# EAGLE schematic solenoid_board (EAGLE 6.3)
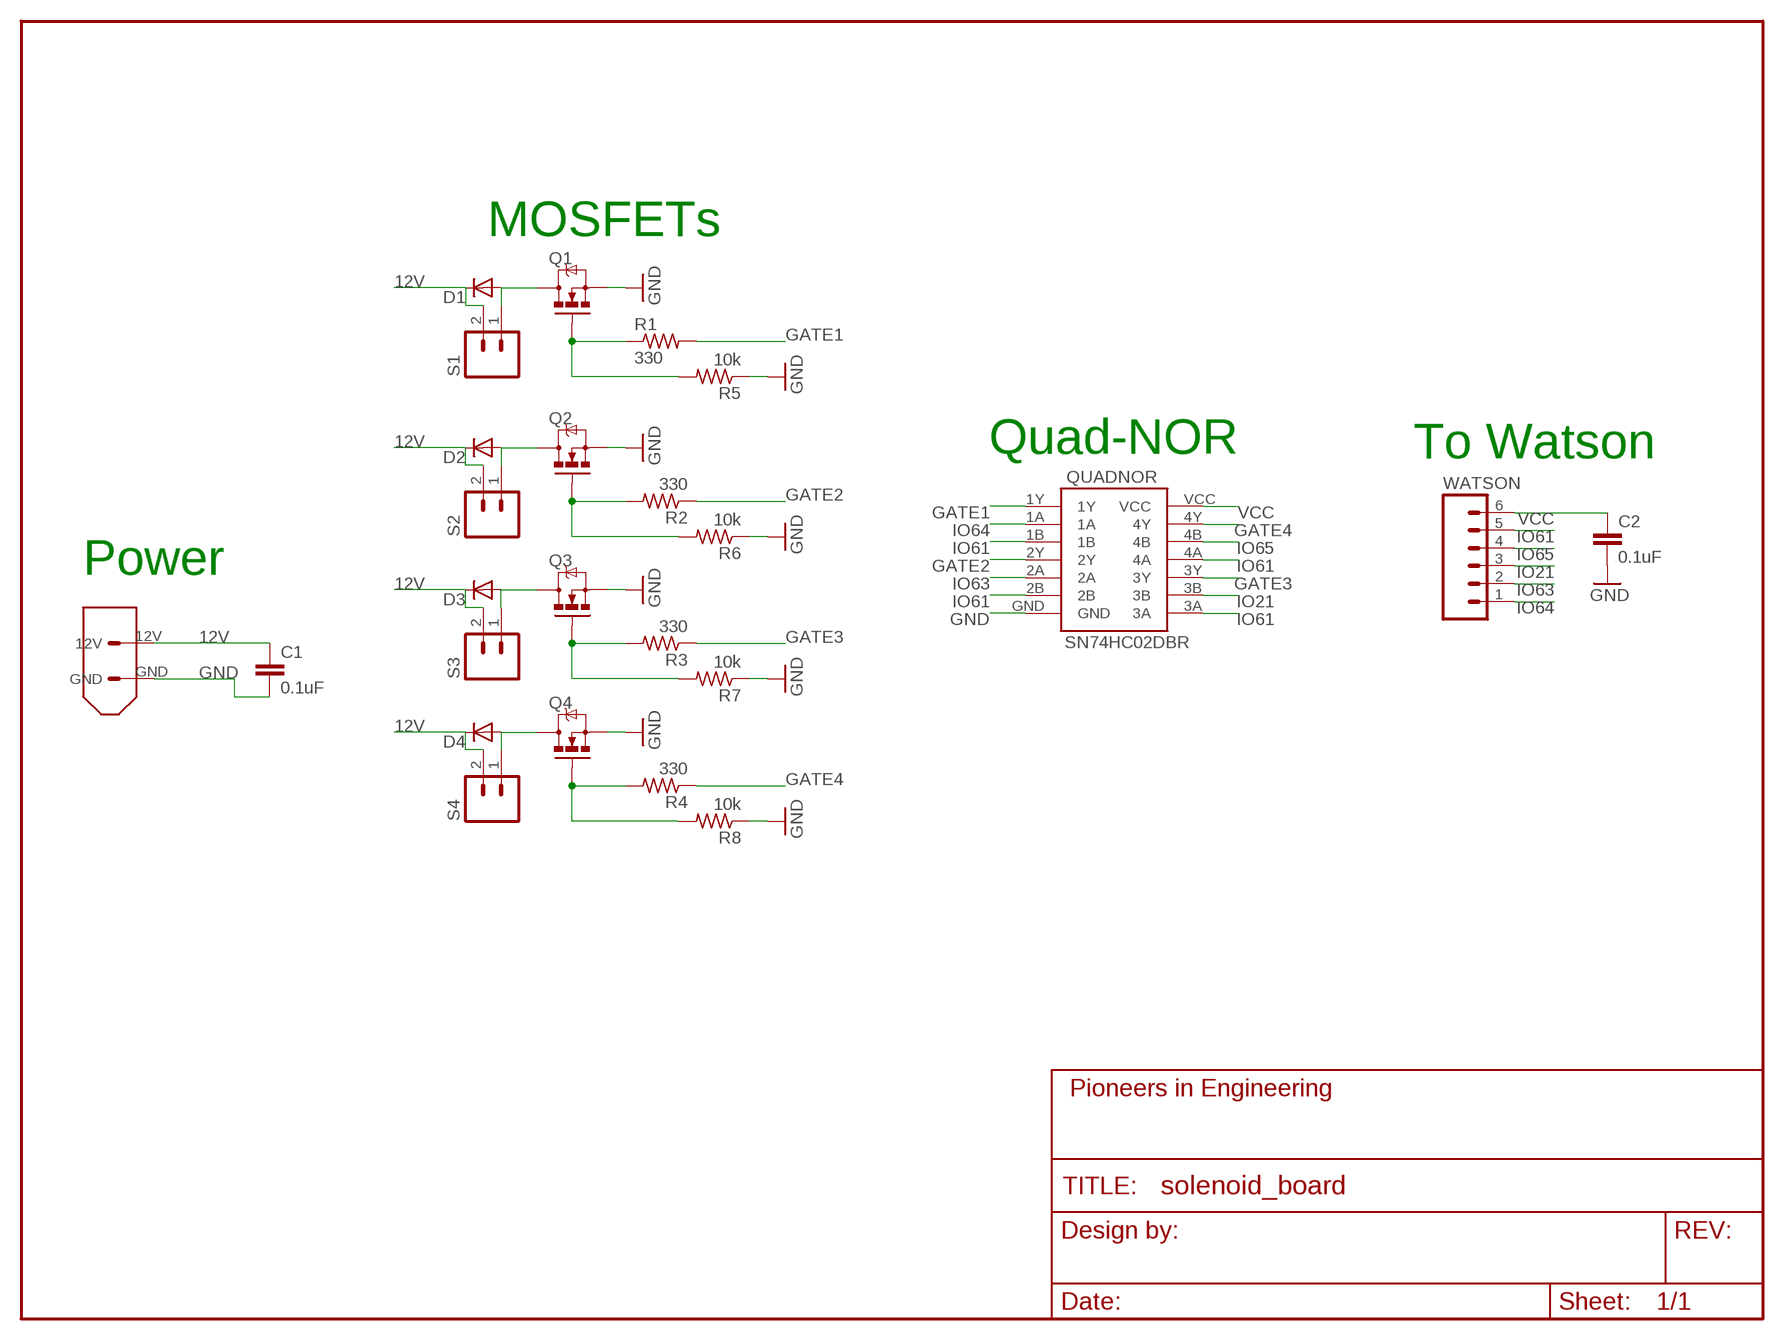
[diagram p0: schematic, sheet 1]
FRAME1 (FRAME-LETTER): AUTHOR: Sumita Ghosh, Sahar Mesri; REVISION: F

## Parts
C1  0.1uF  CAP0603-CAP  [0603-CAP]
C2  0.1uF  CAP0603-CAP  [0603-CAP]
D1  DIODESMA-ALT  [SMA-DIODE_ALT]
D2  DIODESMA-ALT  [SMA-DIODE_ALT]
D3  DIODESMA-ALT  [SMA-DIODE_ALT]
D4  DIODESMA-ALT  [SMA-DIODE_ALT]
Q1  MOSFET-NCHANNELSMD  [SOT23-3]
Q2  MOSFET-NCHANNELSMD  [SOT23-3]
Q3  MOSFET-NCHANNELSMD  [SOT23-3]
Q4  MOSFET-NCHANNELSMD  [SOT23-3]
QUADNOR  SN74HC02DBR  [QUADNOR]
R1  330  R-US_R0603  [R0603]
R2  330  R-US_R0603  [R0603]
R3  330  R-US_R0603  [R0603]
R4  330  R-US_R0603  [R0603]
R5  10k  R-US_R0603  [R0603]
R6  10k  R-US_R0603  [R0603]
R7  10k  R-US_R0603  [R0603]
R8  10k  R-US_R0603  [R0603]
S1  M021X02-MTA  [1X02-MTA]
S2  M021X02-MTA  [1X02-MTA]
S3  M021X02-MTA  [1X02-MTA]
S4  M021X02-MTA  [1X02-MTA]
U$2  XT60CONNECTOR  [XT60CONNECTOR]
WATSON  M06  [1X06-MTA]

## Nets
12V [power]: C1.1 D1.C D2.C D3.C D4.C S1.2 S2.2 S3.2 S4.2 U$2.12V
GATE1: QUADNOR.1Y R1.2
GATE2: QUADNOR.2Y R2.1
GATE3: QUADNOR.3Y R3.1
GATE4: QUADNOR.4Y R4.1
GND: C1.2 C2.2 Q1.2(S) Q2.2(S) Q3.2(S) Q4.2(S) QUADNOR.GND R5.1 R6.1 R7.1 R8.1 U$2.GND
IO21: QUADNOR.3B WATSON.3
IO61: QUADNOR.1B QUADNOR.2B QUADNOR.3A QUADNOR.4A WATSON.5
IO63: QUADNOR.2A WATSON.2
IO64: QUADNOR.1A WATSON.1
IO65: QUADNOR.4B WATSON.4
N$2: D1.A Q1.3(D) S1.1
N$3 [power]: D4.A Q4.3(D) S4.1
N$4 [power]: D3.A Q3.3(D) S3.1
N$8 [power]: D2.A Q2.3(D) S2.1
N$15: Q1.1(G) R1.1 R5.2
N$16: Q2.1(G) R2.2 R6.2
N$17: Q3.1(G) R3.2 R7.2
N$18: Q4.1(G) R4.2 R8.2
VCC: C2.1 QUADNOR.VCC WATSON.6

## Notes on the sheet
- MOSFETs
- Quad-NOR | To Watson
- Power

## Library data of the parts
C1 C2 = pie:CAP: Capacitor Standard 0603 ceramic capacitor, and 0.1" leaded capacitor.
D1-D4 = pie:DIODE: Diode These are standard reverse protection diodes and small signal diodes. SMA package can handle up to about 1A. SOD-323 can handle about 200mA. What the SOD-323 package when ordering, there are some mfgs out there that are 5-pin packages.
Q1-Q4 = pie:MOSFET-NCHANNEL: N-Type MOSFET, SOT23-3 Package
QUADNOR = pie:SN74HC02DBR: Quad-NOR IC, SSOP14 Package, Part Number SN74HC02DBR; PARTNUMBER: 296-8204-1-ND
R1-R8 = pie:R-US_: RESISTOR, American symbol
S1-S4 = pie:M02: 2-pin 0.1-inch header and MTA connector; PARTNUMBER: A1921-ND
U$2 = pie:XT60CONNECTOR: 12V XT60 power connector; PARTNUMBER: PRT-10474
WATSON = pie:M06: 6-pin 0.1-inch MTA connector; PARTNUMBER: A1923-ND

## Net classes
1 power: width 0.406 mm, drill 0.381 mm, clearance 0.203 mm